# EAGLE design M14_Potis (EAGLE 6.1)

## Sheet 1 of 2
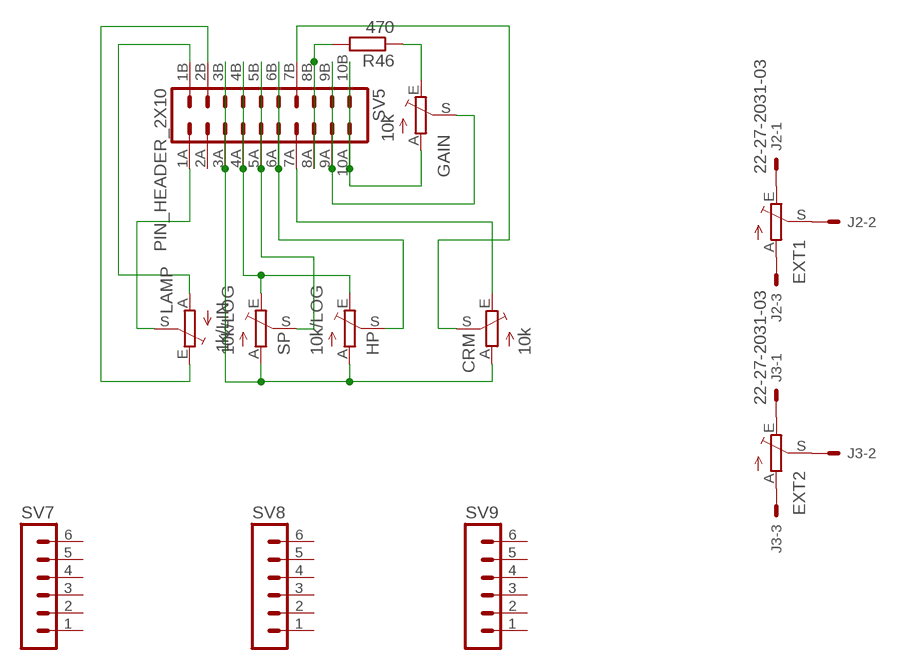
[diagram p0: schematic, sheet 1]

### Parts
CRM  10k  TRIM_EU-PT10  [PT-10]
EXT1  TRIM_EU-PT10  [PT-10]
EXT2  TRIM_EU-PT10  [PT-10]
GAIN  10k  TRIM_EU-PT10  [PT-10]
HP  10k/LOG  TRIM_EU-POT_WHOLE  [POT_NAR]
J2  22-27-2031-03  [6410-03]
J3  22-27-2031-03  [6410-03]
LAMP  1k/LIN  TRIM_EU-POT_WHOLE  [POT_NAR]
R46  470  R-EU_R0805  [R0805]
SP  10k/LOG  TRIM_EU-POT_WHOLE  [POT_NAR]
SV5  PIN_HEADER_2X10  [PIN_HEADER_2X10SMD]
SV7  MA06-1  [MA06-1]
SV8  MA06-1  [MA06-1]
SV9  MA06-1  [MA06-1]

### Nets
N$10: CRM.E SV5.7A
N$11: CRM.A HP.A SP.A SV5.3A SV5.3B
N$30: HP.E SP.E SV5.4A SV5.4B
N$33: SP.S SV5.5A SV5.5B
N$37: EXT1.S J2.2
N$38: EXT2.S J3.2
N$41: EXT1.E J2.1
N$42: EXT1.A J2.3
N$43: LAMP.S SV5.1A
N$44: EXT2.A J3.3
N$45: EXT2.E J3.1
N$47: LAMP.E SV5.2B
N$48: HP.S SV5.6A SV5.6B
N$56: LAMP.A SV5.1B
N$58: CRM.S SV5.7B
N$68: R46.2 SV5.8A SV5.8B
N$69: GAIN.S SV5.9A SV5.9B
N$70: GAIN.A SV5.10A SV5.10B
N$73: GAIN.E R46.1
Unconnected: SV5.2A SV7.1 SV7.2 SV7.3 SV7.4 SV7.5 SV7.6 SV8.1 SV8.2 SV8.3 SV8.4 SV8.5 SV8.6 SV9.1 SV9.2 SV9.3 SV9.4 SV9.5 SV9.6

## Sheet 2 of 2

## Library data of the parts
CRM EXT1 EXT2 GAIN HP LAMP SP = pot:TRIM_EU-: POTENTIOMETER
J2 J3 = con-molex:22-?-03: CONNECTOR wire to board 2.54 mm (.1 inch) pitch header; OC_FARNELL: unknown; OC_NEWARK: unknown
R46 = rcl:R-EU_: RESISTOR, European symbol
SV5 = narval:PIN_HEADER_2X10
SV7-SV9 = con-lstb:MA06-1: PIN HEADER; OC_FARNELL: unknown; OC_NEWARK: unknown

## Board
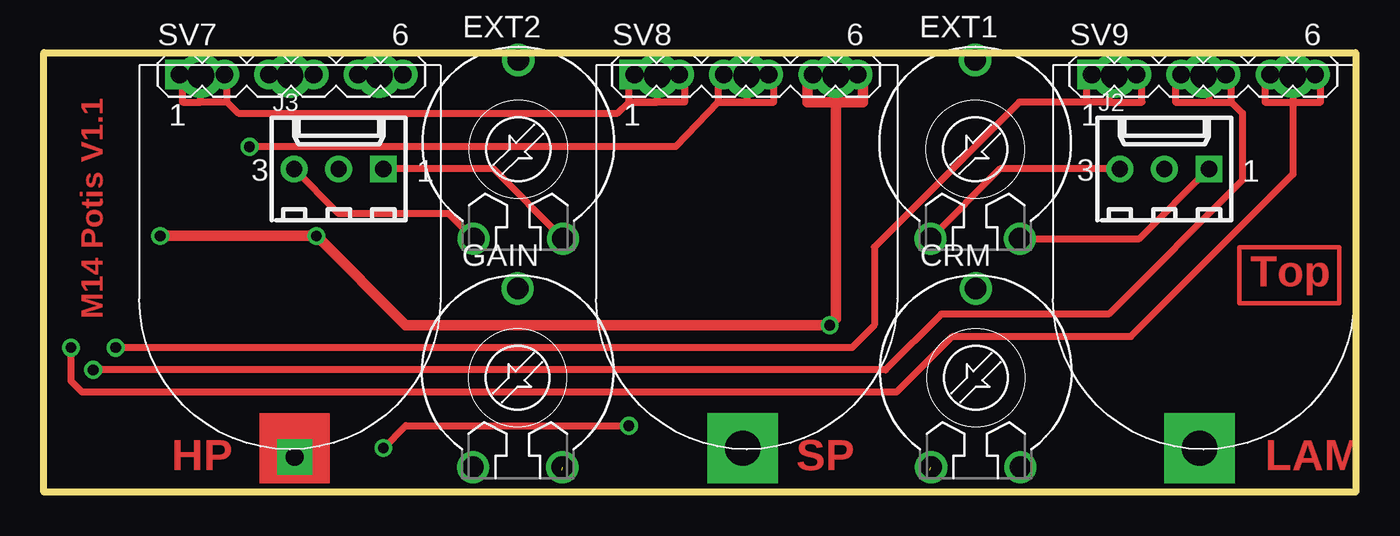
[diagram p1: board, top side]
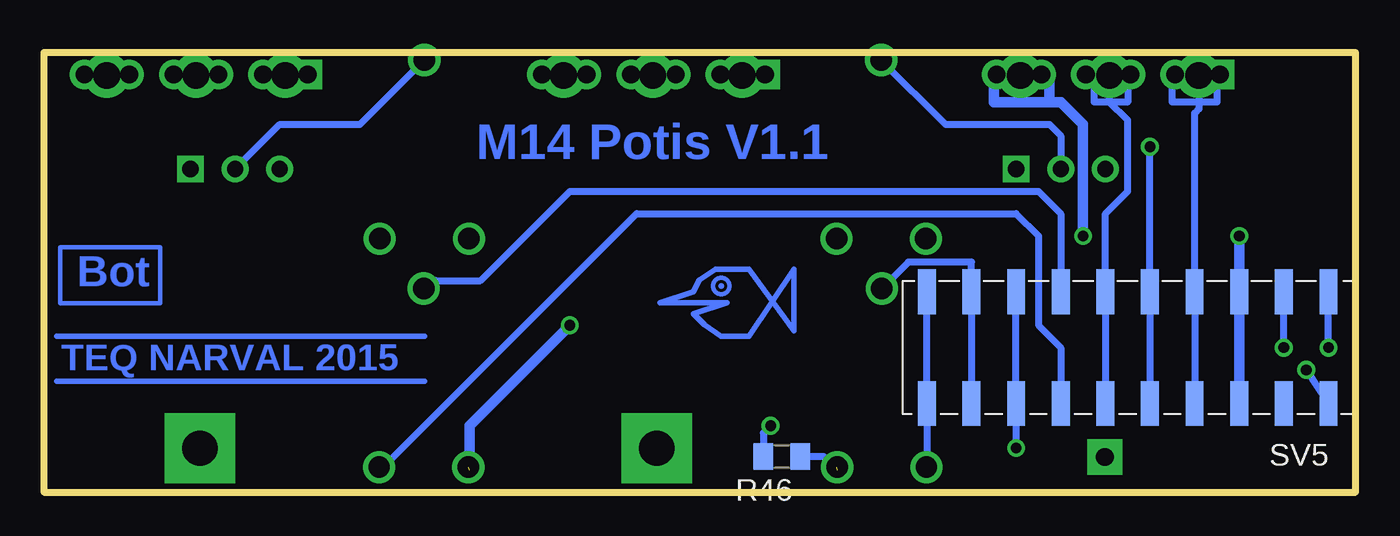
[diagram p2: board, bottom side, seen from below]

Size 74.65 x 25 mm. Coordinates in mm from the lower left corner, seen from the top.
Outline: 0,25 74.65,25 74.65,0 0,0 0,25
Copper layers (1*16): Top 0.035mm / dielectric 1.5mm / Bottom 0.035mm
Design rules: minimum track width 10mil, minimum drill 24mil, track to track 10mil, track to pad 10mil, pad to pad 10mil, via to via 10mil, smd to smd 10mil, copper to edge 10mil, drill to drill 10mil, minimum pad ring 10mil, minimum via ring 8mil, stop-mask expansion 4mil, vias tented up to drill 0mil, thermal gap 10mil

### Footprints (pad centres in the part's own frame; a part is rotated, then mirrored left to right if it is on the bottom)
PT-10 = drill 1.219: A -2.54,-5.08; E 2.54,-5.08; S 0,5.08
POT_NAR = drill 1.524 pad 2.54: A -5.08,-12.7; E 5.08,-12.7; S 0,-12.7
6410-03 = drill 0.914 pad 1.524 square: 1 2.54,0 | drill 0.914 pad 1.524: 2 0,0; 3 -2.54,0
R0805 = smd 1.1 x 1.5: 1 -1.05,0; 2 1.05,0
PIN_HEADER_2X10SMD = smd 1.016 x 2.54: 1A -11.43,3.175; 1B -11.43,-3.175; 2A -8.89,3.175; 2B -8.89,-3.175; 3A -6.35,3.175; 3B -6.35,-3.175; 4A -3.81,3.175; 4B -3.81,-3.175; 5A -1.27,3.175; 5B -1.27,-3.175; 6A 1.27,3.175; 6B 1.27,-3.175; 7A 3.81,3.175; 7B 3.81,-3.175; 8A 6.35,3.175; 8B 6.35,-3.175; 9A 8.89,3.175; 9B 8.89,-3.175; 10A 11.43,3.175; 10B 11.43,-3.175
MA06-1 = drill 1.016 pad 1.676 square: 1 -6.35,0 | drill 1.016 pad 1.676: 2 -3.81,0; 3 -1.27,0; 4 1.27,0; 5 3.81,0; 6 6.35,0

### Placement (x,y rotation side)
CRM  53.04,6.5 0 top
EXT1  53,19.5 0 top
EXT2  27,19.5 0 top
GAIN  26.96,6.5 0 top
HP  14,11 180 top
J2  63.77,18.38 0 top
J3  16.78,18.38 0 top
LAMP  66,11 180 top
R46  32.66,2.03 180 bottom
SP  40,11 180 top
SV5  12.97,8.22 180 bottom
SV7  14.08,23.75 0 top
SV8  39.96,23.75 0 top
SV9  65.99,23.75 0 top

### Tracks (layer width: path | path; a pad name or v marks a point on that pad's centre or on a via)
HALACSKA3
  Bottom 0.305: 31.98,12.68 31.98,9.19 34.52,12.68 36.42,12.68 37.37,12.05 37.69,11.41 39.6,10.77 35.79,10.77 37.69,10.14 37.06,9.51 36.1,8.87 34.52,8.87 31.98,12.68
N$1  (via drill 2 pad 4)
  other vias: 39.77,2.49
N$2  (via drill 2 pad 4)
  other vias: 65.77,2.49
N$3  (via drill 1 pad 2)
  other vias: 14.27,1.99
N$4
  Bottom 0.406: 12.97,23.46 12.97,22.19 14.88,22.19 14.88,23.46
N$5
  Bottom 0.61: 18.05,22.19 20.59,22.19 20.59,23.46
N$6
  Top 0.61: 43.45,23.46 43.45,22.19 46.62,22.19 46.62,23.46
N$7
  Top 0.406: 38.37,23.46 38.37,22.19 41.55,22.19 41.55,23.46
N$8
  Top 0.406: 36.47,24.1 36.47,22.19 33.29,22.19 33.29,23.46
N$9
  Top 0.406: 64.41,23.46 64.41,22.19 67.58,22.19 67.58,23.46
N$10
  Bottom 0.406: SV5.7A 16.78,8.22 18.05,9.49 18.05,14.57 19.32,15.84 40.91,15.84 54.88,1.87 CRM.E
N$11  (via drill 0.61)  (1 unrouted)
  Top 0.61: v6.62,14.57 v15.51,14.57 20.59,9.49 v44.72,9.49 45.08,9.85 SP.A
  Bottom 0.61: v15.51,14.57 15.51,20.92 16.78,22.19 17.41,22.19 | 17.41,22.19 19.08,22.19 HP.A | v6.62,14.57 SV5.3B SV5.3A | v44.72,9.49 50.44,3.77 50.44,1.23 | 17.41,22.19 17.41,23.46
N$12
  Top 0.406: 69.48,23.46 69.48,22.19 72.66,22.19 72.66,23.46
N$13
  Bottom 0.406: 7.89,23.46 7.89,22.19 10.43,22.19 10.43,23.46
N$14
  Bottom 0.305: 73.93,8.86 52.98,8.86
N$15
  Bottom 0.305: 52.98,6.32 73.93,6.32
N$30
  Top 0.406: 8.92,22.19 7.89,22.19 7.89,23.46 | 10.43,22.19 11.06,21.55 32.66,21.55 33.29,22.19 34.92,22.19 SP.E | 10.43,22.19 10.43,23.46 | 10.43,22.19 8.92,22.19 | 8.92,22.19 HP.E
  Bottom 0.406: SV5.4A SV5.4B 9.16,21.55 8.92,21.8 HP.E
N$33  (via drill 0.61)
  Top 0.406: v11.7,19.65 35.95,19.65 38.37,22.19 40,22.19 SP.S
  Bottom 0.406: v11.7,19.65 SV5.5B SV5.5A
N$37
  Bottom 0.406: J2.2 61.23,20.92 56.66,20.92 EXT1.S
N$38
  Bottom 0.406: EXT2.S 23.34,20.92 17.41,20.92 16.78,20.29 J3.2
N$41
  Top 0.406: EXT1.E 62.35,14.42 J2.1
N$42
  Top 0.406: J2.3 54.42,18.38 EXT1.A
N$43  (via drill 0.61)
  Top 0.406: LAMP.S 66.31,23.46 66.31,22.19 67.58,22.19 68.21,21.55 68.21,17.74 60.6,10.13 51.07,10.13 47.9,6.95 v2.81,6.95
  Bottom 0.406: 1.54,4.41 SV5.1A v2.81,6.95
N$44
  Top 0.406: EXT2.A 23.04,15.84 16.78,15.84 J3.3
N$45
  Top 0.406: EXT2.E 25.58,18.38 J3.1
N$47  (via drill 0.61)
  Top 0.406: v4.08,8.22 45.99,8.22 47.26,9.49 47.26,13.93 55.52,22.19 59.33,22.19 | 60.6,22.19 60.6,23.46 LAMP.E | 60.6,22.19 59.33,22.19 | 59.33,23.46 59.33,22.19 | 60.6,22.19 62.5,22.19 62.5,23.46
  Bottom 0.406: v4.08,8.22 SV5.2B
N$48
  Bottom 0.406: HP.S 14,22.19 12.97,21.16 12.97,17.11 14.24,15.84 SV5.6B SV5.6A
N$56  (via drill 0.61)
  Top 0.406: v1.54,8.22 1.54,6.32 2.17,5.68 48.53,5.68 51.71,8.86 61.87,8.86 71.08,18.07 LAMP.A
  Bottom 0.406: v1.54,8.22 SV5.1B
N$58
  Bottom 0.406: SV5.7B 16.78,15.84 18.05,17.11 44.72,17.11 49.8,12.03 52.34,12.03 CRM.S
N$68  (via drill 0.61)
  Top 0.406: v19.32,2.51 20.59,3.77 v33.29,3.77
  Bottom 0.406: SV5.8B SV5.8A v19.32,2.51 | v33.29,3.77 33.71,3.36 R46.2
N$69
  Bottom 0.406: GAIN.S 25.46,13.09 21.86,13.09 SV5.9B SV5.9A
N$70
  Bottom 0.406: GAIN.A 24.4,1.45 SV5.10A SV5.10B
N$73  (1 unrouted)
  Bottom 0.406: R46.1 30.27,2.03 29.48,1.23
N$96
  Bottom 0.254: 68.02,10.74 68.02,13.92 73.74,13.92 73.74,10.74 68.02,10.74
N$103
  Top 0.254: 73.74,10.74 73.74,13.92 68.02,13.92 68.02,10.74 73.74,10.74
(copper drawn outside any net)
  shapes: Bottom circle x2, Top area x1

### Text on the board
Top: Top | M14 Potis V1.1 | HP | SP | LAM
Bottom: M14 Potis V1.1 | Bot | TEQ NARVAL 2015